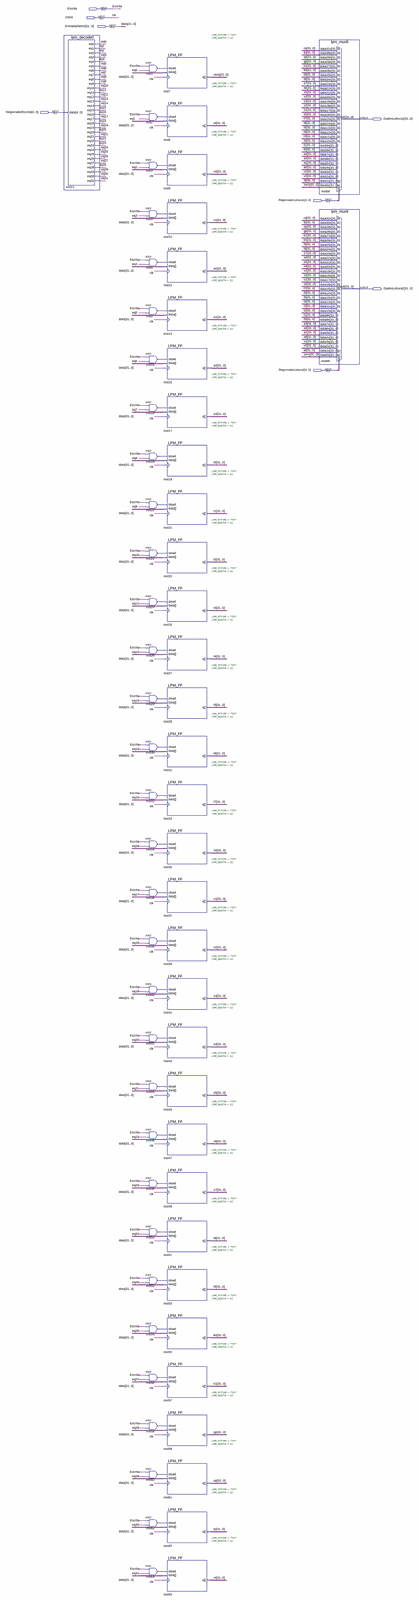
[diagram p0: schematic sheet, whole]
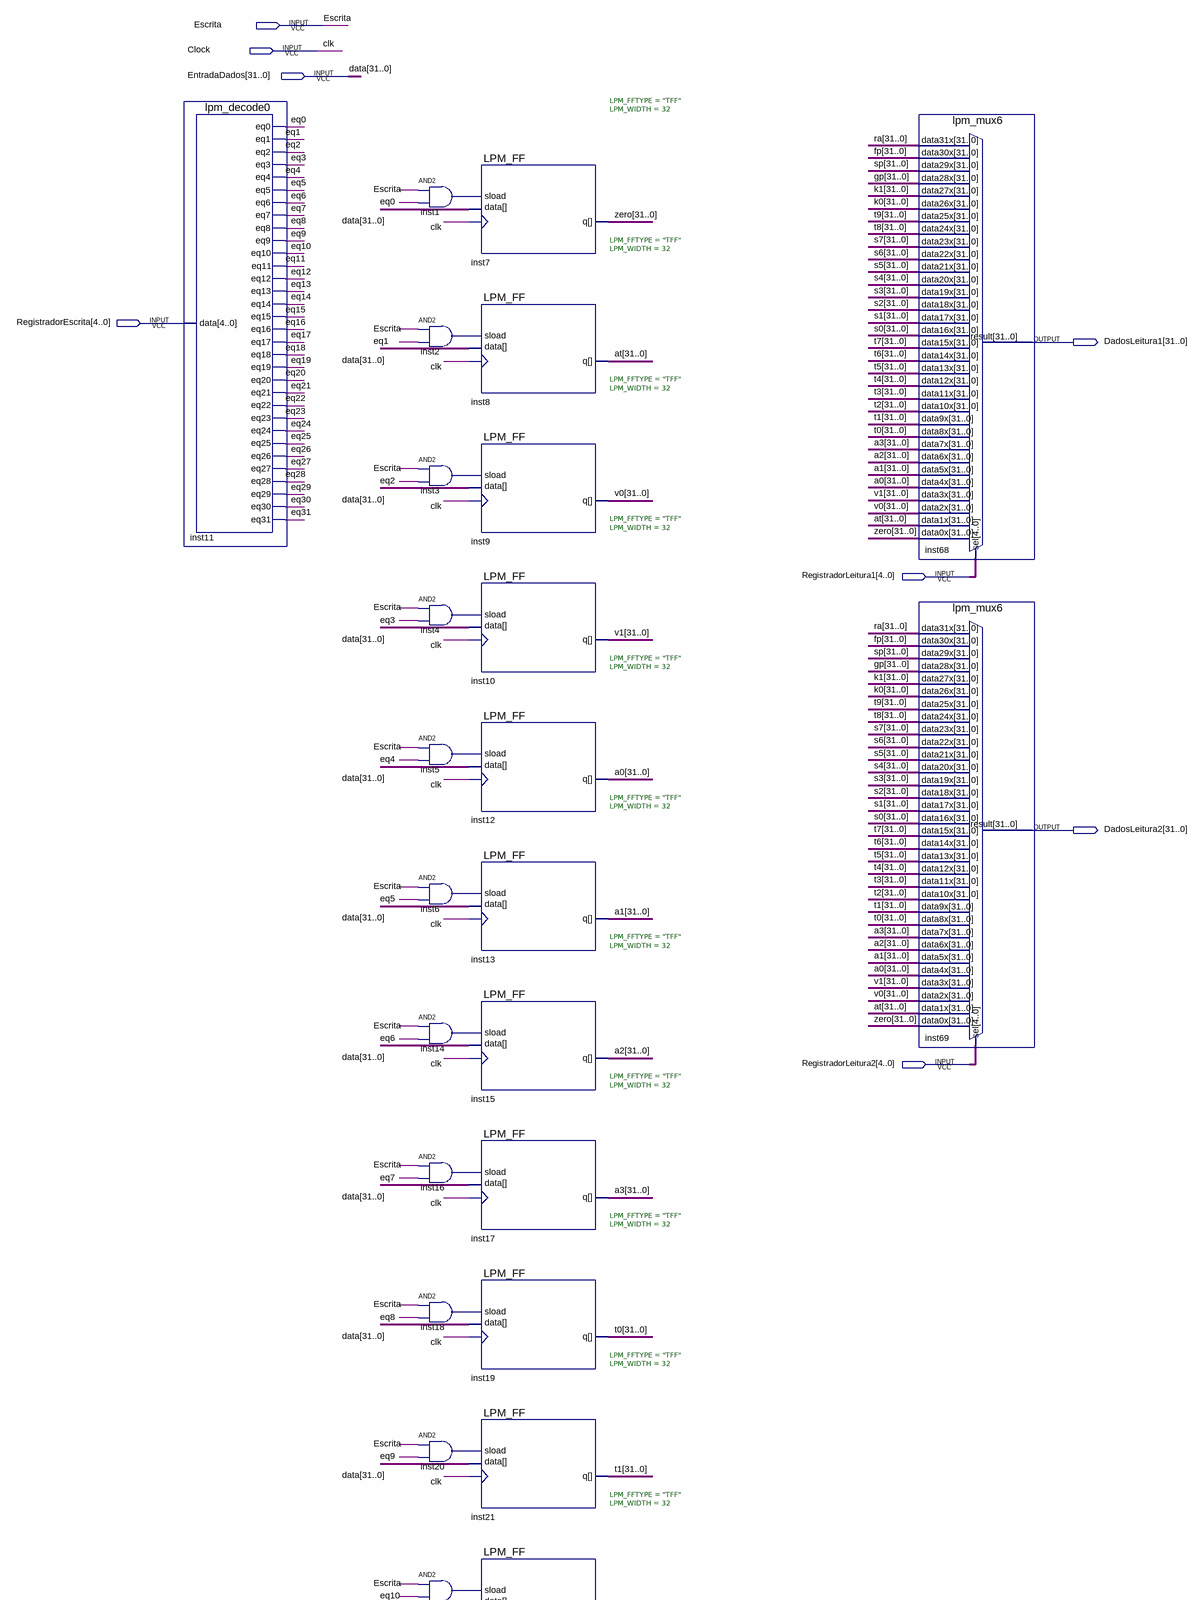
[diagram p1: schematic sheet, upper part]
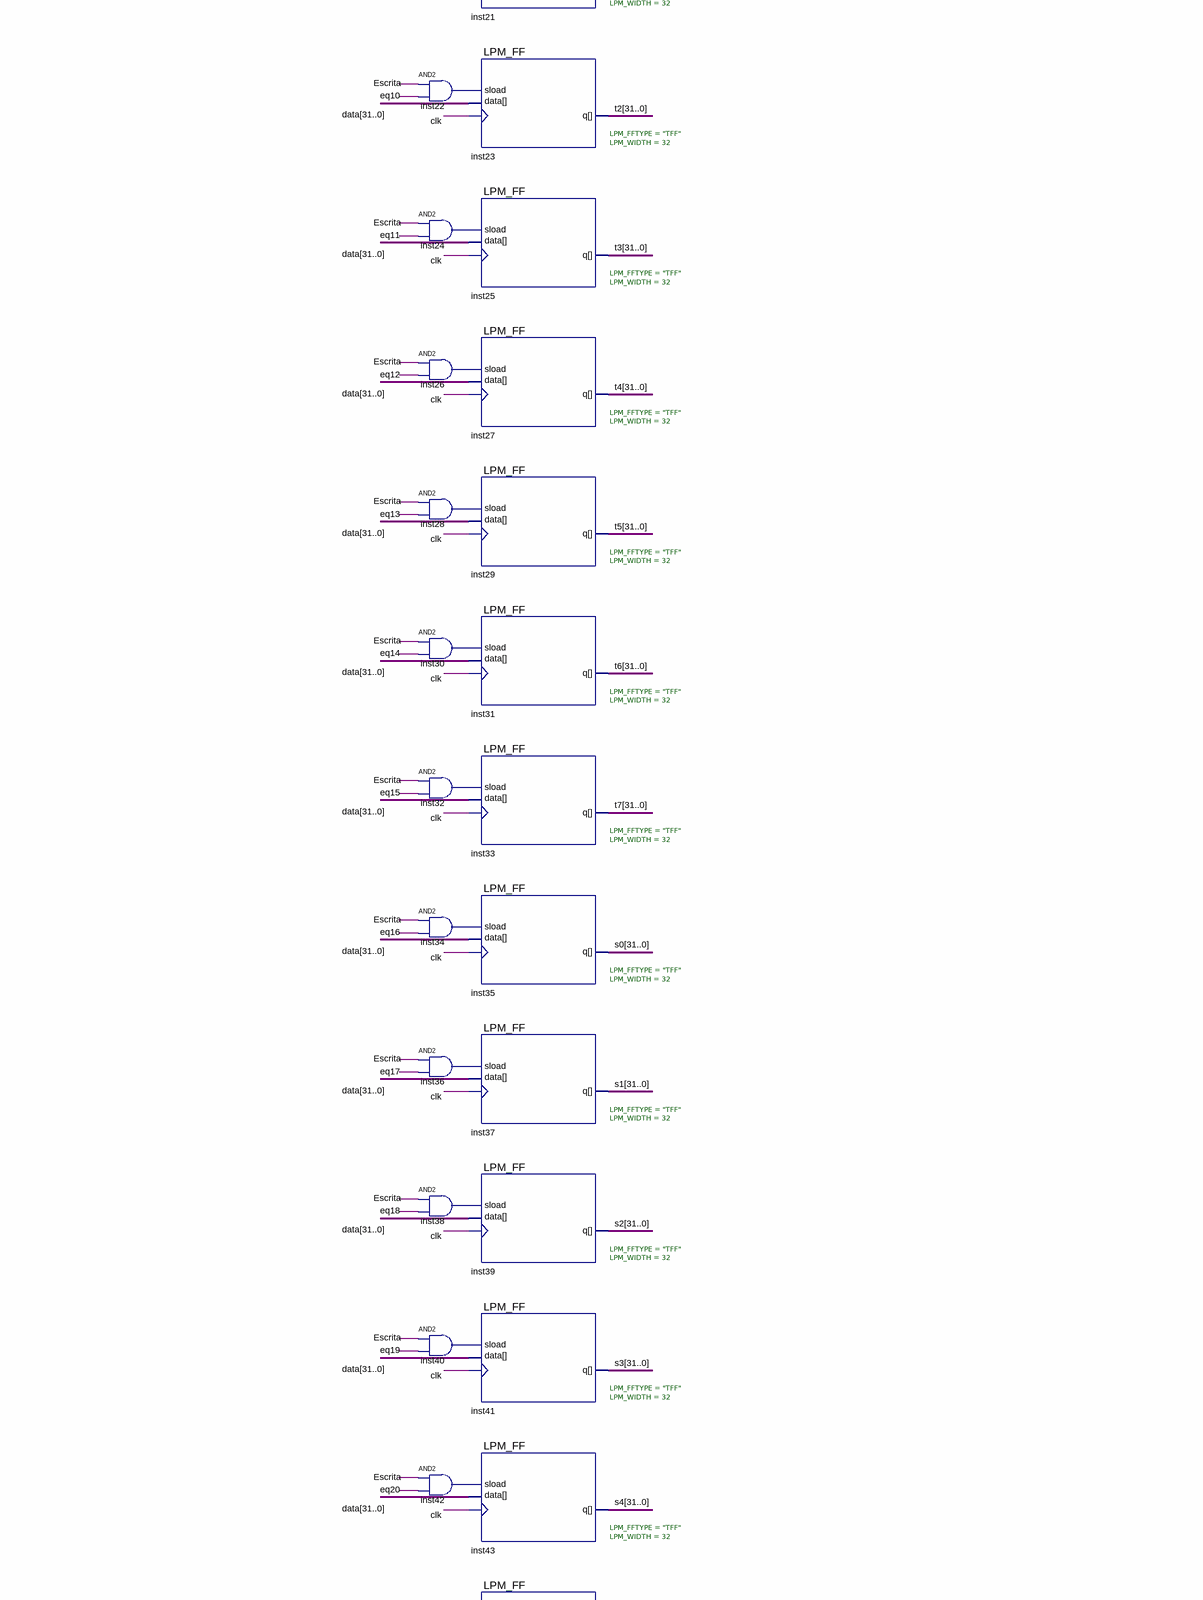
[diagram p2: schematic sheet, middle part]
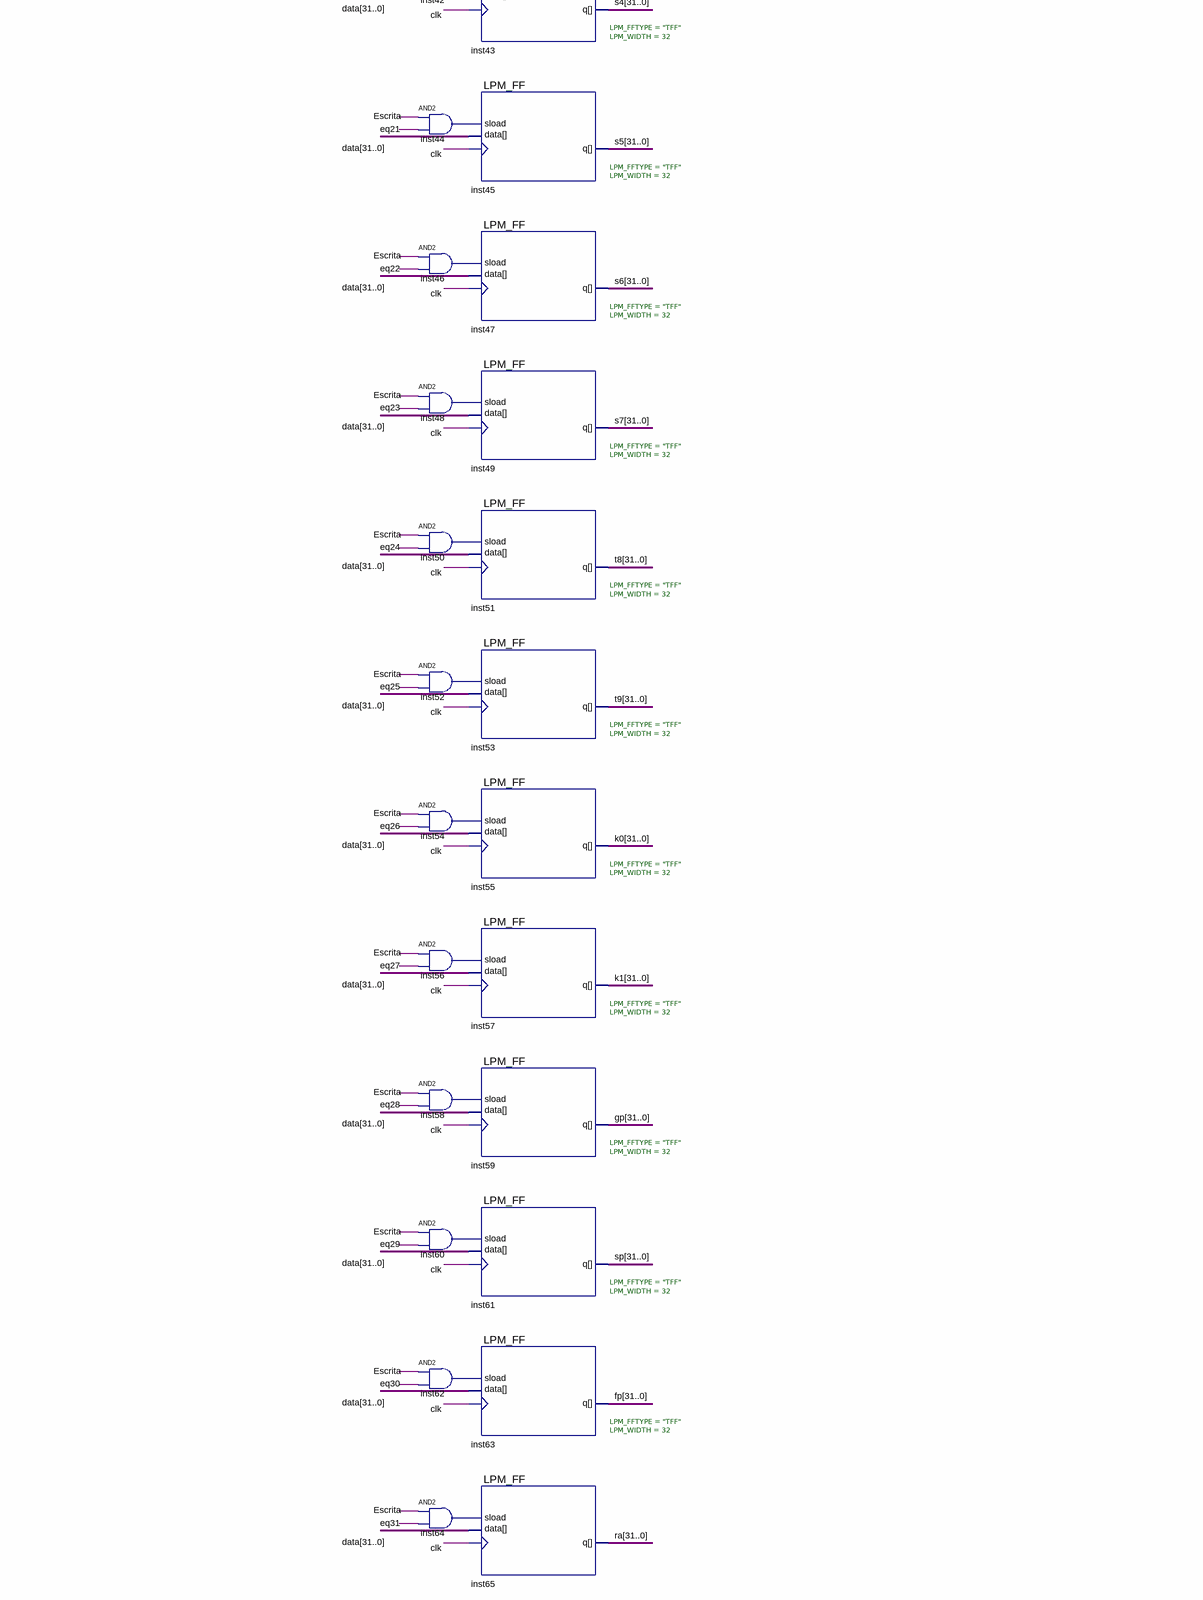
[diagram p3: schematic sheet, lower part]
// Quartus schematic BancoRegistradoresT.bdf as structural Verilog: 67 symbols, 8 pins
module BancoRegistradoresT (
  input  Escrita,
  input  Clock,
  input  [31:0] EntradaDados,
  input  [4:0] RegistradorEscrita,
  input  [4:0] RegistradorLeitura1,
  input  [4:0] RegistradorLeitura2,
  output [31:0] DadosLeitura1,
  output [31:0] DadosLeitura2
);

  wire eq0, eq1, eq2, eq3, eq4, eq5, eq6, eq7, eq8, eq9, eq10, eq11, eq12, eq13, eq14, eq15, eq16, eq17,
       eq18, eq19, eq20, eq21, eq22, eq23, eq24, eq25, eq26, eq27, eq28, eq29, eq30, eq31, inst1_out,
       inst2_out, inst3_out, inst4_out, inst5_out, inst6_out, inst14_out, inst16_out, inst18_out, inst20_out,
       inst22_out, inst24_out, inst26_out, inst28_out, inst30_out, inst32_out, inst34_out, inst36_out,
       inst38_out, inst40_out, inst42_out, inst44_out, inst46_out, inst48_out, inst50_out, inst52_out,
       inst54_out, inst56_out, inst58_out, inst60_out, inst62_out, inst64_out;
  wire [31:0] a0, a1, a2, a3, at, fp, gp, k0, k1, ra, s0, s1, s2, s3, s4, s5, s6, s7, sp, t0, t1, t2, t3, t4,
       t5, t6, t7, t8, t9, v0, v1, zero;

  lpm_decode0 inst11 (
    .data(RegistradorEscrita), .eq0(eq0), .eq1(eq1), .eq2(eq2), .eq3(eq3), .eq4(eq4), .eq5(eq5), .eq6(eq6),
    .eq7(eq7), .eq8(eq8), .eq9(eq9), .eq10(eq10), .eq11(eq11), .eq12(eq12), .eq13(eq13), .eq14(eq14),
    .eq15(eq15), .eq16(eq16), .eq17(eq17), .eq18(eq18), .eq19(eq19), .eq20(eq20), .eq21(eq21), .eq22(eq22),
    .eq23(eq23), .eq24(eq24), .eq25(eq25), .eq26(eq26), .eq27(eq27), .eq28(eq28), .eq29(eq29), .eq30(eq30),
    .eq31(eq31));
  and inst1 (inst1_out, Escrita, eq0);
  and inst2 (inst2_out, Escrita, eq1);
  and inst3 (inst3_out, Escrita, eq2);
  and inst4 (inst4_out, Escrita, eq3);
  and inst5 (inst5_out, Escrita, eq4);
  and inst6 (inst6_out, Escrita, eq5);
  and inst14 (inst14_out, Escrita, eq6);
  and inst16 (inst16_out, Escrita, eq7);
  and inst18 (inst18_out, Escrita, eq8);
  and inst20 (inst20_out, Escrita, eq9);
  and inst22 (inst22_out, Escrita, eq10);
  and inst24 (inst24_out, Escrita, eq11);
  and inst26 (inst26_out, Escrita, eq12);
  and inst28 (inst28_out, Escrita, eq13);
  and inst30 (inst30_out, Escrita, eq14);
  and inst32 (inst32_out, Escrita, eq15);
  and inst34 (inst34_out, Escrita, eq16);
  and inst36 (inst36_out, Escrita, eq17);
  and inst38 (inst38_out, Escrita, eq18);
  and inst40 (inst40_out, Escrita, eq19);
  and inst42 (inst42_out, Escrita, eq20);
  and inst44 (inst44_out, Escrita, eq21);
  and inst46 (inst46_out, Escrita, eq22);
  and inst48 (inst48_out, Escrita, eq23);
  and inst50 (inst50_out, Escrita, eq24);
  and inst52 (inst52_out, Escrita, eq25);
  and inst54 (inst54_out, Escrita, eq26);
  and inst56 (inst56_out, Escrita, eq27);
  and inst58 (inst58_out, Escrita, eq28);
  and inst60 (inst60_out, Escrita, eq29);
  and inst62 (inst62_out, Escrita, eq30);
  and inst64 (inst64_out, Escrita, eq31);
  LPM_FF #(.LPM_FFTYPE("TFF"), .LPM_WIDTH(32)) inst7 (.clock(Clock), .data(EntradaDados), .sload(inst1_out), .q(zero));
  LPM_FF #(.LPM_FFTYPE("TFF"), .LPM_WIDTH(32)) inst8 (.clock(Clock), .data(EntradaDados), .sload(inst2_out), .q(at));
  LPM_FF #(.LPM_FFTYPE("TFF"), .LPM_WIDTH(32)) inst9 (.clock(Clock), .data(EntradaDados), .sload(inst3_out), .q(v0));
  LPM_FF #(.LPM_FFTYPE("TFF"), .LPM_WIDTH(32)) inst10 (.clock(Clock), .data(EntradaDados), .sload(inst4_out), .q(v1));
  LPM_FF #(.LPM_FFTYPE("TFF"), .LPM_WIDTH(32)) inst12 (.clock(Clock), .data(EntradaDados), .sload(inst5_out), .q(a0));
  LPM_FF #(.LPM_FFTYPE("TFF"), .LPM_WIDTH(32)) inst13 (.clock(Clock), .data(EntradaDados), .sload(inst6_out), .q(a1));
  LPM_FF #(.LPM_FFTYPE("TFF"), .LPM_WIDTH(32)) inst15 (.clock(Clock), .data(EntradaDados), .sload(inst14_out), .q(a2));
  LPM_FF #(.LPM_FFTYPE("TFF"), .LPM_WIDTH(32)) inst17 (.clock(Clock), .data(EntradaDados), .sload(inst16_out), .q(a3));
  LPM_FF #(.LPM_FFTYPE("TFF"), .LPM_WIDTH(32)) inst19 (.clock(Clock), .data(EntradaDados), .sload(inst18_out), .q(t0));
  LPM_FF #(.LPM_FFTYPE("TFF"), .LPM_WIDTH(32)) inst21 (.clock(Clock), .data(EntradaDados), .sload(inst20_out), .q(t1));
  LPM_FF #(.LPM_FFTYPE("TFF"), .LPM_WIDTH(32)) inst23 (.clock(Clock), .data(EntradaDados), .sload(inst22_out), .q(t2));
  LPM_FF #(.LPM_FFTYPE("TFF"), .LPM_WIDTH(32)) inst25 (.clock(Clock), .data(EntradaDados), .sload(inst24_out), .q(t3));
  LPM_FF #(.LPM_FFTYPE("TFF"), .LPM_WIDTH(32)) inst27 (.clock(Clock), .data(EntradaDados), .sload(inst26_out), .q(t4));
  LPM_FF #(.LPM_FFTYPE("TFF"), .LPM_WIDTH(32)) inst29 (.clock(Clock), .data(EntradaDados), .sload(inst28_out), .q(t5));
  LPM_FF #(.LPM_FFTYPE("TFF"), .LPM_WIDTH(32)) inst31 (.clock(Clock), .data(EntradaDados), .sload(inst30_out), .q(t6));
  LPM_FF #(.LPM_FFTYPE("TFF"), .LPM_WIDTH(32)) inst33 (.clock(Clock), .data(EntradaDados), .sload(inst32_out), .q(t7));
  LPM_FF #(.LPM_FFTYPE("TFF"), .LPM_WIDTH(32)) inst35 (.clock(Clock), .data(EntradaDados), .sload(inst34_out), .q(s0));
  LPM_FF #(.LPM_FFTYPE("TFF"), .LPM_WIDTH(32)) inst37 (.clock(Clock), .data(EntradaDados), .sload(inst36_out), .q(s1));
  LPM_FF #(.LPM_FFTYPE("TFF"), .LPM_WIDTH(32)) inst39 (.clock(Clock), .data(EntradaDados), .sload(inst38_out), .q(s2));
  LPM_FF #(.LPM_FFTYPE("TFF"), .LPM_WIDTH(32)) inst41 (.clock(Clock), .data(EntradaDados), .sload(inst40_out), .q(s3));
  LPM_FF #(.LPM_FFTYPE("TFF"), .LPM_WIDTH(32)) inst43 (.clock(Clock), .data(EntradaDados), .sload(inst42_out), .q(s4));
  LPM_FF #(.LPM_FFTYPE("TFF"), .LPM_WIDTH(32)) inst45 (.clock(Clock), .data(EntradaDados), .sload(inst44_out), .q(s5));
  LPM_FF #(.LPM_FFTYPE("TFF"), .LPM_WIDTH(32)) inst47 (.clock(Clock), .data(EntradaDados), .sload(inst46_out), .q(s6));
  LPM_FF #(.LPM_FFTYPE("TFF"), .LPM_WIDTH(32)) inst49 (.clock(Clock), .data(EntradaDados), .sload(inst48_out), .q(s7));
  LPM_FF #(.LPM_FFTYPE("TFF"), .LPM_WIDTH(32)) inst51 (.clock(Clock), .data(EntradaDados), .sload(inst50_out), .q(t8));
  LPM_FF #(.LPM_FFTYPE("TFF"), .LPM_WIDTH(32)) inst53 (.clock(Clock), .data(EntradaDados), .sload(inst52_out), .q(t9));
  LPM_FF #(.LPM_FFTYPE("TFF"), .LPM_WIDTH(32)) inst55 (.clock(Clock), .data(EntradaDados), .sload(inst54_out), .q(k0));
  LPM_FF #(.LPM_FFTYPE("TFF"), .LPM_WIDTH(32)) inst57 (.clock(Clock), .data(EntradaDados), .sload(inst56_out), .q(k1));
  LPM_FF #(.LPM_FFTYPE("TFF"), .LPM_WIDTH(32)) inst59 (.clock(Clock), .data(EntradaDados), .sload(inst58_out), .q(gp));
  LPM_FF #(.LPM_FFTYPE("TFF"), .LPM_WIDTH(32)) inst61 (.clock(Clock), .data(EntradaDados), .sload(inst60_out), .q(sp));
  LPM_FF #(.LPM_FFTYPE("TFF"), .LPM_WIDTH(32)) inst63 (.clock(Clock), .data(EntradaDados), .sload(inst62_out), .q(fp));
  LPM_FF #(.LPM_FFTYPE("TFF"), .LPM_WIDTH(32)) inst65 (.clock(Clock), .data(EntradaDados), .sload(inst64_out), .q(ra));
  lpm_mux6 inst68 (
    .data31x(ra), .data30x(fp), .data29x(sp), .data28x(gp), .data27x(k1), .data26x(k0), .data25x(t9),
    .data24x(t8), .data23x(s7), .data22x(s6), .data21x(s5), .data20x(s4), .data19x(s3), .data18x(s2),
    .data17x(s1), .data16x(s0), .data15x(t7), .data14x(t6), .data13x(t5), .data12x(t4), .data11x(t3),
    .data10x(t2), .data9x(t1), .data8x(t0), .data7x(a3), .data6x(a2), .data5x(a1), .data4x(a0), .data3x(v1),
    .data2x(v0), .data1x(at), .data0x(zero), .sel(RegistradorLeitura1), .result(DadosLeitura1));
  lpm_mux6 inst69 (
    .data31x(ra), .data30x(fp), .data29x(sp), .data28x(gp), .data27x(k1), .data26x(k0), .data25x(t9),
    .data24x(t8), .data23x(s7), .data22x(s6), .data21x(s5), .data20x(s4), .data19x(s3), .data18x(s2),
    .data17x(s1), .data16x(s0), .data15x(t7), .data14x(t6), .data13x(t5), .data12x(t4), .data11x(t3),
    .data10x(t2), .data9x(t1), .data8x(t0), .data7x(a3), .data6x(a2), .data5x(a1), .data4x(a0), .data3x(v1),
    .data2x(v0), .data1x(at), .data0x(zero), .sel(RegistradorLeitura2), .result(DadosLeitura2));

  // Other names for the same wires on the sheet: clk = Clock; data[31:0] = EntradaDados
endmodule
